# Altium schematic sheet 01_PSU.SchDoc
size A3; SheetNumber: 1
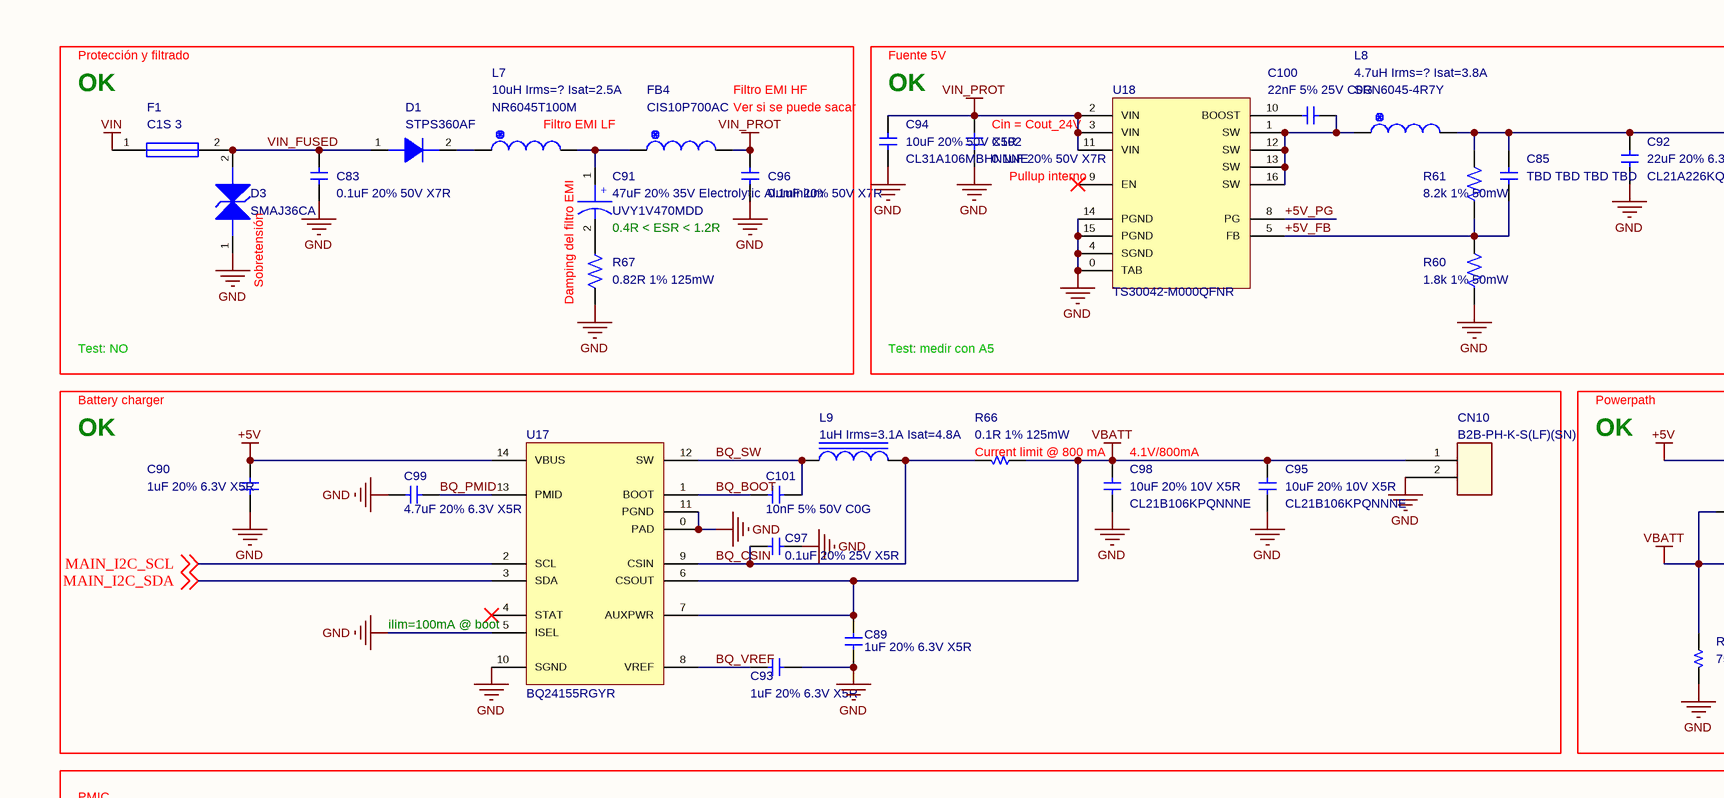
[diagram p0: 01_PSU.SchDoc, top left]
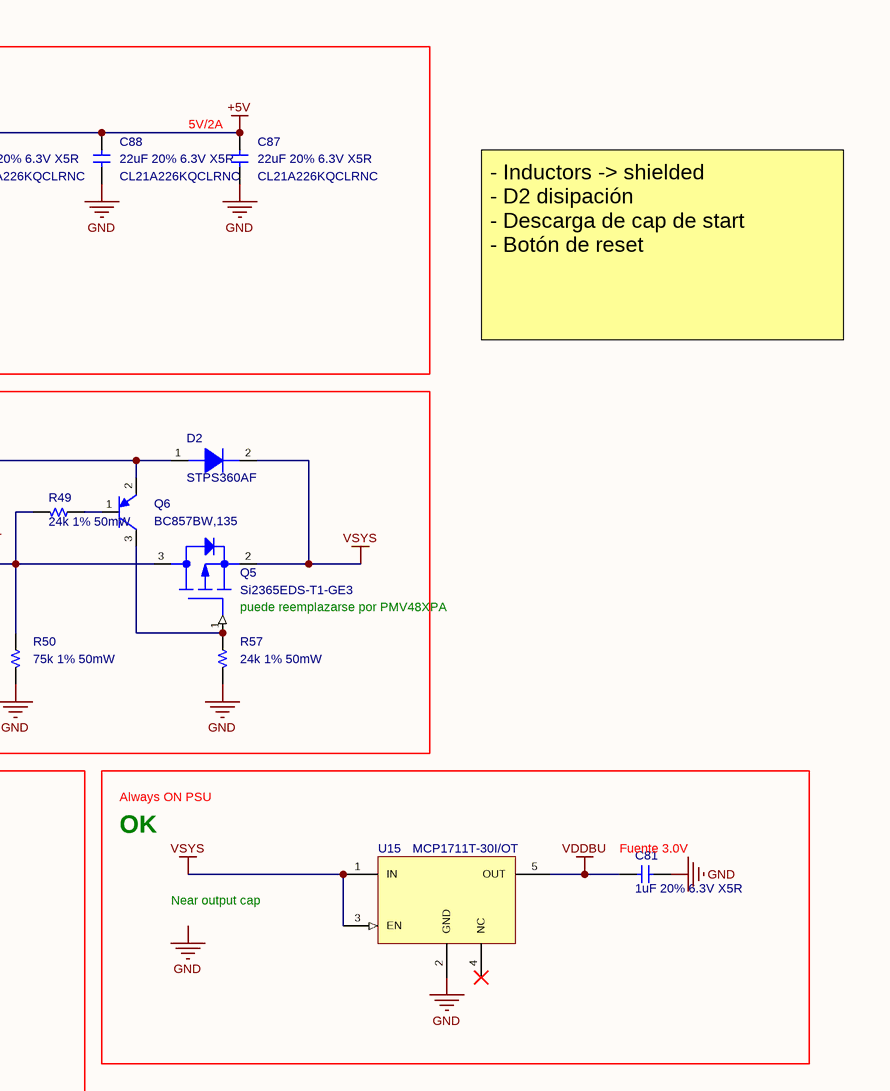
[diagram p1: 01_PSU.SchDoc, top right]
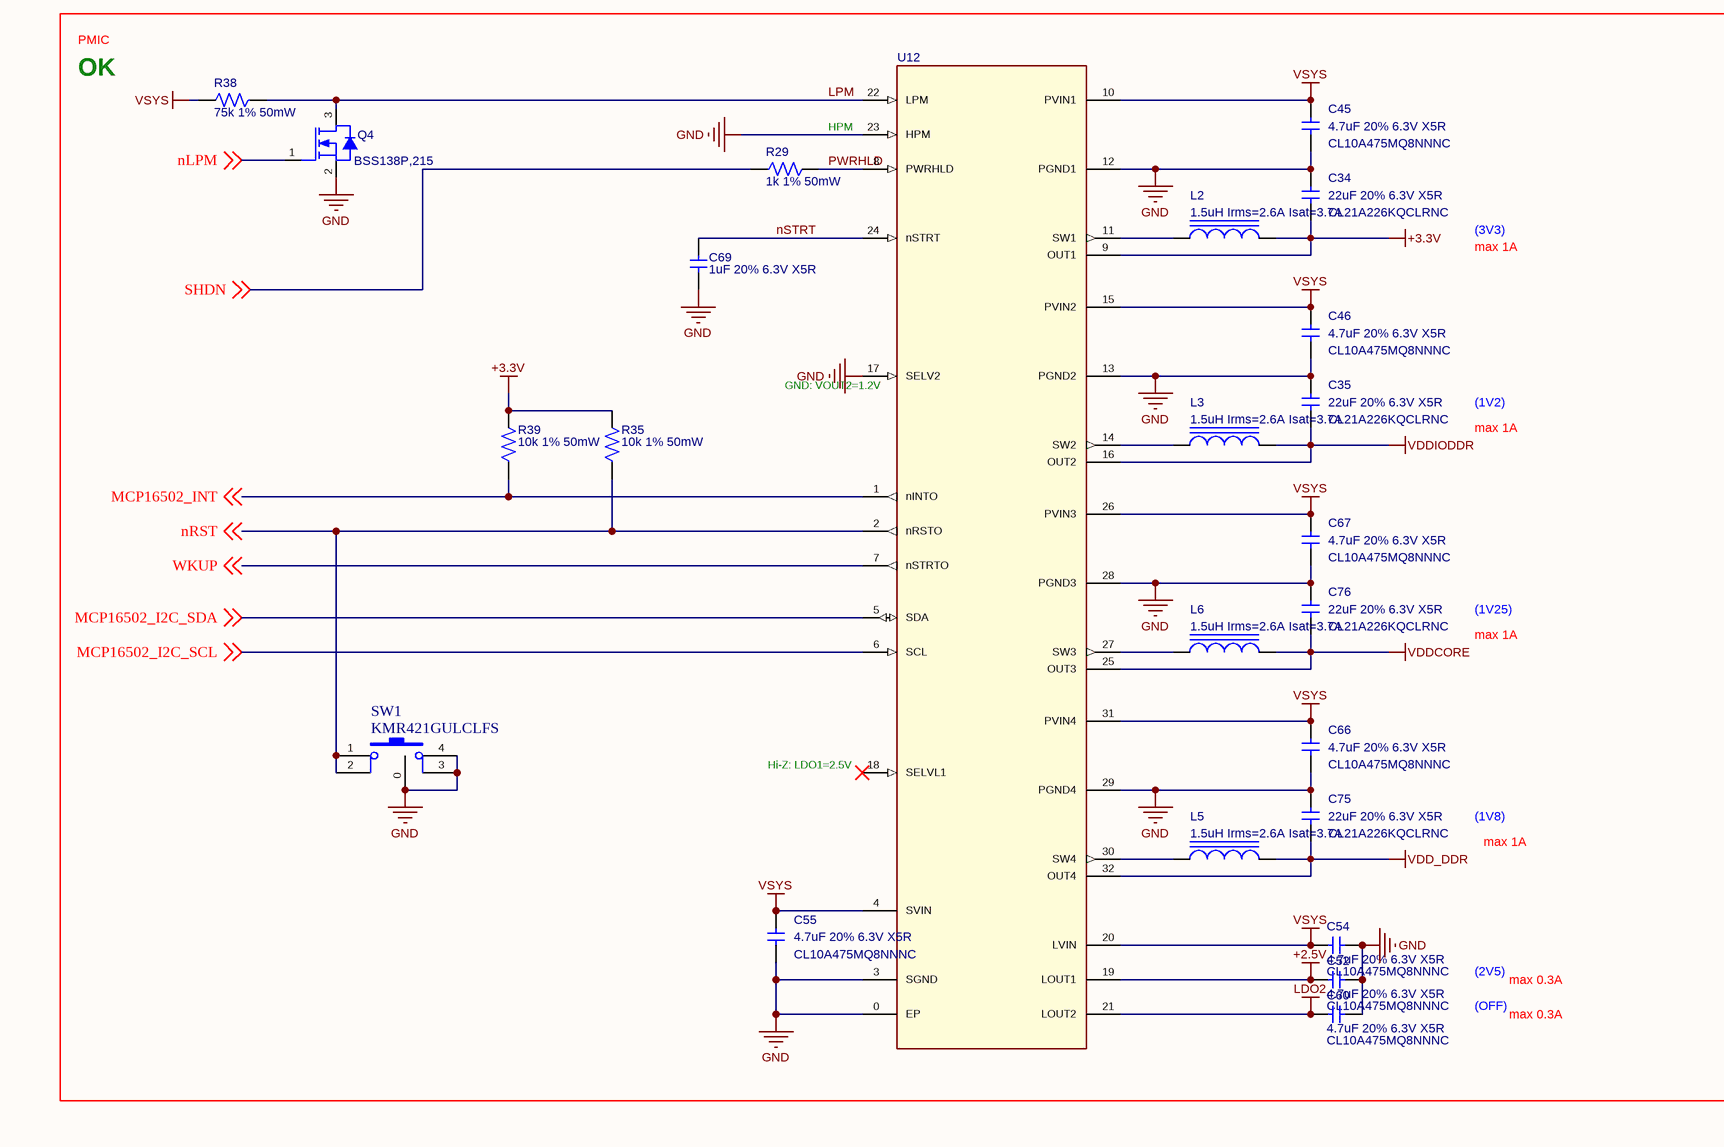
[diagram p2: 01_PSU.SchDoc, bottom left]

## Parts
C34  22uF 20% 6.3V X5R  MFG_PN: CL21A226KQCLRNC  [CAPC2012X140N]
C35  22uF 20% 6.3V X5R  MFG_PN: CL21A226KQCLRNC  [CAPC2012X140N]
C45  4.7uF 20% 6.3V X5R  MFG_PN: CL10A475MQ8NNNC  [CAPC1608X90N]
C46  4.7uF 20% 6.3V X5R  MFG_PN: CL10A475MQ8NNNC  [CAPC1608X90N]
C52  4.7uF 20% 6.3V X5R  MFG_PN: CL10A475MQ8NNNC  [CAPC1608X90N]
C54  4.7uF 20% 6.3V X5R  MFG_PN: CL10A475MQ8NNNC  [CAPC1608X90N]
C55  4.7uF 20% 6.3V X5R  MFG_PN: CL10A475MQ8NNNC  [CAPC1608X90N]
C60  4.7uF 20% 6.3V X5R  MFG_PN: CL10A475MQ8NNNC  [CAPC1608X90N]
C66  4.7uF 20% 6.3V X5R  MFG_PN: CL10A475MQ8NNNC  [CAPC1608X90N]
C67  4.7uF 20% 6.3V X5R  MFG_PN: CL10A475MQ8NNNC  [CAPC1608X90N]
C69  1uF 20% 6.3V X5R  [CAPC1005N]
C75  22uF 20% 6.3V X5R  MFG_PN: CL21A226KQCLRNC  [CAPC2012X140N]
C76  22uF 20% 6.3V X5R  MFG_PN: CL21A226KQCLRNC  [CAPC2012X140N]
C81  1uF 20% 6.3V X5R  [CAPC1005N]
C83  0.1uF 20% 50V X7R  [CAPC1608X90N]
C85  TBD TBD TBD TBD  [CAPC1005N]
C87  22uF 20% 6.3V X5R  MFG_PN: CL21A226KQCLRNC  [CAPC2012X140N]
C88  22uF 20% 6.3V X5R  MFG_PN: CL21A226KQCLRNC  [CAPC2012X140N]
C89  1uF 20% 6.3V X5R  [CAPC1005N]
C90  1uF 20% 6.3V X5R  [CAPC1005N]
C91  47uF 20% 35V Electrolytic Aluminium  MFG_PN: UVY1V470MDD  [CAPPR2-5x12]
C92  22uF 20% 6.3V X5R  MFG_PN: CL21A226KQCLRNC  [CAPC2012X140N]
C93  1uF 20% 6.3V X5R  [CAPC1005N]
C94  10uF 20% 50V X5R  MFG_PN: CL31A106MBHNNNE  [CAPC3216X180N]
C95  10uF 20% 10V X5R  MFG_PN: CL21B106KPQNNNE  [CAPC2012X140N]
C96  0.1uF 20% 50V X7R  [CAPC1608X90N]
C97  0.1uF 20% 25V X5R  [CAPC1005N]
C98  10uF 20% 10V X5R  MFG_PN: CL21B106KPQNNNE  [CAPC2012X140N]
C99  4.7uF 20% 6.3V X5R  [CAPC1608X90N]
C100  22nF 5% 25V C0G  [CAPC1005N]
C101  10nF 5% 50V C0G  [CAPC1005N]
C102  0.1uF 20% 50V X7R  [CAPC1608X90N]
CN10  B2B-PH-K-S(LF)(SN)  [B2B-PH-K-S(LF)(SN)]
D1  STPS360AF  [SODFL4725X105N]
D2  STPS360AF  [SODFL4725X105N]
D3  SMAJ36CA  [DIOM5226X203N]
F1  C1S 3  [RESC3216N]
FB4  CIS10P700AC  [INDC1608X95N]
L2  1.5uH Irms=2.6A Isat=3.7A  [INDC2520N]
L3  1.5uH Irms=2.6A Isat=3.7A  [INDC2520N]
L5  1.5uH Irms=2.6A Isat=3.7A  [INDC2520N]
L6  1.5uH Irms=2.6A Isat=3.7A  [INDC2520N]
L7  10uH Irms=? Isat=2.5A  MFG_PN: NR6045T100M  [NR6045]
L8  4.7uH Irms=? Isat=3.8A  MFG_PN: SRN6045-4R7Y  [SRN6045]
L9  1uH Irms=3.1A Isat=4.8A  [INDC2520N]
Q4  BSS138P,215  [SOT95P230X110-3N]
Q5  Si2365EDS-T1-GE3  [SOT95P230X110-3N]
Q6  BC857BW,135  [SOT65P210X110-3N]
R29  1k 1% 50mW  [RESC1005X40N]
R35  10k 1% 50mW  [RESC1005X40N]
R38  75k 1% 50mW  [RESC1005X40N]
R39  10k 1% 50mW  [RESC1005X40N]
R49  24k 1% 50mW  [RESC1005X40N]
R50  75k 1% 50mW  [RESC1005X40N]
R57  24k 1% 50mW  [RESC1005X40N]
R60  1.8k 1% 50mW  [RESC1005X40N]
R61  8.2k 1% 50mW  [RESC1005X40N]
R66  0.1R 1% 125mW  [RESC2012X50N]
R67  0.82R 1% 125mW  [RESC2012X50N]
SW1  KMR421GULCLFS  [KMR4]
U12  MCP16502TAC-E/S8B  [QFN50P500X500X90-33N]  (value not drawn)
U15  MCP1711T-30I/OT  [SOT95P284X122-5N]
U17  BQ24155RGYR  [VQFN14]
U18  TS30042-M000QFNR  [QFN50P300X300X100-17AN]

## Blocks framed on the sheet
OK: C83 C91 C96 D1 D3 F1 FB4 L7 R67
OK: C85 C87 C88 C92 C94 C100 C102 L8 R60 R61 U18
OK: C89 C90 C93 C95 C97-C99 C101 CN10 L9 R66 U17
OK: D2 Q5 Q6 R49 R50 R57
OK: C34 C35 C45 C46 C52 C54 C55 C60 C66 C67 C69 C75 C76 L2 L3 L5 L6 Q4 R29 R35 R38 R39 SW1 U12
OK: C81 U15

## Nets
+2.5V: C52.1 U12.19(LOUT1)
+3.3V: C34.2 L2.2 R35.2 R39.2 U12.9(OUT1)
+5V: C85.2 C87.1 C88.1 C90.1 C92.1 D2.1(A) L8.2 Q6.2(E) R61.2 U17.14(VBUS)
GND: C34.1 C35.1 C45.2 C46.2 C52.2 C54.2 C55.2 C60.2 C66.2 C67.2 C69.2 C75.1 C76.1 C81.1 C83.2 C87.2 C88.2 C89.1 C90.2 C92.2 C93.1 C94.2 C95.2 C96.2 C97.1 C98.2 C99.2 C102.2 CN10.2 D3.1(ANODE) Q4.2(S) R50.2 R57.2 R60.1 R67.2 SW1.0(M) SW1.3 SW1.4 U12.0(EP) U12.3(SGND) U12.12(PGND1) U12.13(PGND2) U12.17(SELV2) U12.23(HPM) U12.28(PGND3) U12.29(PGND4) U15.2(GND) U17.0(PAD) U17.5(ISEL) U17.10(SGND) U17.11(PGND) U18.0(TAB) U18.4(SGND) U18.14(PGND) U18.15(PGND)
LDO2: C60.1 U12.21(LOUT2)
VBATT: C89.2 C95.1 C98.1 CN10.1 Q5.3(DRAIN) R49.2 R50.1 R66.1 U17.6(CSOUT) U17.7(AUXPWR)
VDD_DDR: C75.2 L5.2 U12.32(OUT4)
VDDBU: C81.2 U15.5(OUT)
VDDCORE: C76.2 L6.2 U12.25(OUT3)
VDDIODDR: C35.2 L3.2 U12.16(OUT2)
VIN: F1.1
VIN_PROT: C94.1 C96.1 C102.1 FB4.2 U18.2(VIN) U18.3(VIN) U18.11(VIN)
VSYS: C45.1 C46.1 C54.1 C55.1 C66.1 C67.1 D2.2(K) Q5.2(SOURCE) R38.2 U12.4(SVIN) U12.10(PVIN1) U12.15(PVIN2) U12.20(LVIN) U12.26(PVIN3) U12.31(PVIN4) U15.1(IN) U15.3(EN)
+5V_FB: C85.1 R60.2 R61.1 U18.5(FB)
+5V_PG: U18.8(PG)
BQ_BOOT: C101.2 U17.1(BOOT)
BQ_CSIN: C97.2 L9.2 R66.2 U17.9(CSIN)
BQ_PMID: C99.1 U17.13(PMID)
BQ_SW: C101.1 L9.1 U17.12(SW)
BQ_VREF: C93.2 U17.8(VREF)
LPM: Q4.3(D) R38.1 U12.22(LPM)
MAIN_I2C_SCL: U17.2(SCL) ; off-sheet MAIN_I2C_SCL
MAIN_I2C_SDA: U17.3(SDA) ; off-sheet MAIN_I2C_SDA
MCP16502_I2C_SCL: U12.6(SCL) ; off-sheet MCP16502_I2C_SCL
MCP16502_I2C_SDA: U12.5(SDA) ; off-sheet MCP16502_I2C_SDA
MCP16502_INT: R39.1 U12.1(nINTO) ; off-sheet MCP16502_INT
nLPM: Q4.1(G) ; off-sheet nLPM
nRST: R35.1 SW1.1 SW1.2 U12.2(nRSTO) ; off-sheet nRST
nSTRT: C69.1 U12.24(nSTRT)
PWRHLD: R29.2 U12.8(PWRHLD)
SHDN: R29.1 ; off-sheet SHDN
VIN_FUSED: C83.1 D1.1(A) D3.2(CATHODE) F1.2
WKUP: U12.7(nSTRTO) ; off-sheet WKUP
NetC91_1: C91.1 FB4.1 L7.2
NetC91_2: C91.2 R67.1
NetC100_1: C100.1 L8.1 U18.1(SW) U18.12(SW) U18.13(SW) U18.16(SW)
NetC100_2: C100.2 U18.10(BOOST)
NetD1_2: D1.2(K) L7.1
NetL2_1: L2.1 U12.11(SW1)
NetL3_1: L3.1 U12.14(SW2)
NetL5_1: L5.1 U12.30(SW4)
NetL6_1: L6.1 U12.27(SW3)
NetQ5_1: Q5.1(GATE) Q6.3(C) R57.1
NetQ6_1: Q6.1(B) R49.1

Not connected (* = marked no-connect by the designer): U12 18(SELVL1)*; U15 4(NC)*; U17 4(STAT)*; U18 9(EN)*

## Notes on the sheet
- Protección y filtrado
- Filtro EMI LF
- Filtro EMI HF
- Ver si se puede sacar
- Fuente 5V
- (near C102) Cin = Cout_24V
- (near C87) 5V/2A
- (near U18) Pullup interno
- (near D3) Sobretensión
- Damping del filtro EMI
- 0.4R < ESR < 1.2R
- Test: NO
- Test: medir con A5
- - Inductors -> shielded
  - D2 disipación
  - Descarga de cap de start
  - Botón de reset
- Battery charger
- (near R66) Current limit @ 800 mA
- (near C98) 4.1V/800mA
- Powerpath
- (near U17) ilim=100mA @ boot
- (near Q5) puede reemplazarse por PMV48XPA
- PMIC
- Always ON PSU
- HPM
- Near output cap
- (near C81) Fuente 3.0V
- (3V3)
- max 1A
- (near U12) GND: VOUT2=1.2V
- (1V2)
- (1V25)
- (near U12) Hi-Z: LDO1=2.5V
- (1V8)
- (2V5)
- (OFF)
- max 0.3A
- Labels drawn without touching a wire or pin: GND
- (in symbol CP) +

## Library data of the parts
C34 C35 C75 C76 C87 C88 C92 = C_Dup1: Capacitor, Ceramic; FP_DESC: C0805; MFG: SAMSUNG; Symbol Checked: Ok; Replacement Allowed: Ask; Footprint Checked: Assign OK, Footprint OK; TECHNOLOGY: X5R; TOLERANCE: 20%; VALUE: 22uF; VOLTAGE: 6.3V
C45 C46 C52 C54 C55 C60 C66 C67 = C_Dup1: Capacitor, Ceramic; FP_DESC: C0603; MFG: SAMSUNG; Symbol Checked: Ok; Replacement Allowed: Ask; Footprint Checked: Assign OK, Footprint OK; TECHNOLOGY: X5R; TOLERANCE: 20%; VALUE: 4.7uF; VOLTAGE: 6.3V
C69 C90 = C_Dup1: Capacitor, Ceramic; MFG: SAMSUNG; MFG_PN: CL05A105KQ5NNNC; FP_DESC: C0402; Symbol Checked: Ok; Replacement Allowed: Ask; Footprint Checked: Assign OK, Footprint OK; TECHNOLOGY: X5R; TOLERANCE: 20%; VALUE: 1uF; VOLTAGE: 6.3V
C81 C89 C93 = C: Capacitor, Ceramic; MFG: SAMSUNG; Symbol Checked: Ok; FP_DESC: C0402; MFG_PN: CL05A105KQ5NNNC; Replacement Allowed: Ask; Footprint Checked: Assign OK, Footprint OK; Value: 1uF; TOLERANCE: 20%; VOLTAGE: 6.3V; TECHNOLOGY: X5R
C83 C96 C102 = C_Dup1: Capacitor, Ceramic; MFG: SAMSUNG; MFG_PN: CL10B104KB8NNWC; FP_DESC: C0603; Symbol Checked: Ok; Replacement Allowed: Ask; Footprint Checked: Assign OK, Footprint OK; TECHNOLOGY: X7R; TOLERANCE: 20%; VALUE: 0.1uF; VOLTAGE: 50V
C85 C100 = C_Dup1: Capacitor, Ceramic; FP_DESC: C0402; MFG_PN: <GENERIC>; Symbol Checked: Ok; Replacement Allowed: Yes; MFG: <GENERIC>; Footprint Checked: Assign OK, Footprint OK
  C85: TECHNOLOGY: TBD; TOLERANCE: TBD; VALUE: TBD; VOLTAGE: TBD
  C100: TECHNOLOGY: C0G; TOLERANCE: 5%; VALUE: 22nF; VOLTAGE: 25V
C91 = CP: Capacitor, Electrolytic; FP_DESC: Cap. Pol. D=5mm, LS=2mm, H=12.5mm; MFG: NICHICON; Symbol Checked: Ok; Replacement Allowed: Ask; Footprint Checked: Assign OK, Footprint OK; TECHNOLOGY: Electrolytic Aluminium; TOLERANCE: 20%; VALUE: 47uF; VOLTAGE: 35V
C94 = C_Dup1: Capacitor, Ceramic; FP_DESC: C1206; MFG: SAMSUNG; Symbol Checked: Ok; Replacement Allowed: Ask; Footprint Checked: Assign OK, Footprint OK; TECHNOLOGY: X5R; TOLERANCE: 20%; VALUE: 10uF; VOLTAGE: 50V
C95 C98 = C_Dup1: Capacitor, Ceramic; MFG: SAMSUNG; FP_DESC: C0805; Symbol Checked: Ok; Replacement Allowed: Ask; Footprint Checked: Assign OK, Footprint OK; TECHNOLOGY: X5R; TOLERANCE: 20%; VALUE: 10uF; VOLTAGE: 10V
C97 = C_Dup1: Capacitor, Ceramic; FP_DESC: C0402; MFG_PN: CL05A104KA5NNNC; MFG: SAMSUNG; Symbol Checked: Ok; Replacement Allowed: Ask; Footprint Checked: Assign OK, Footprint OK; TECHNOLOGY: X5R; TOLERANCE: 20%; VALUE: 0.1uF; VOLTAGE: 25V
C99 = C: Capacitor, Ceramic; MFG: SAMSUNG; Symbol Checked: Ok; FP_DESC: C0603; MFG_PN: CL10A475MQ8NNNC; Replacement Allowed: Ask; Footprint Checked: Assign OK, Footprint OK; Value: 4.7uF; TOLERANCE: 20%; VOLTAGE: 6.3V; TECHNOLOGY: X5R
C101 = C: Capacitor, Ceramic; MFG: <GENERIC>; Symbol Checked: Ok; FP_DESC: C0402; Replacement Allowed: Yes; Footprint Checked: Assign OK, Footprint OK; MFG_PN: <GENERIC>; Value: 10nF; TOLERANCE: 5%; VOLTAGE: 50V; TECHNOLOGY: C0G
CN10 = CON2: Header, Male pins, 1x2, 2mm, Vertical; MFG: JST; Symbol Checked: Ok; Replacement Allowed: Ask; MFG_PN: B2B-PH-K-S(LF)(SN); FP_DESC: Header, Male pins, 1x2, 2mm, Vertical; Footprint Checked: Assign OK, Footprint OK
D1 D2 = DIODE_1: DIODE; FP_DESC: SOD128; MFG: ST; Symbol Checked: Ok; Replacement Allowed: No; MFG_PN: STPS360AF; Footprint Checked: Assign OK, Footprint OK
D3 = TVS: FP_DESC: SMA; MFG: BOURNS; Symbol Checked: Ok; Replacement Allowed: No; MFG_PN: SMAJ36CA; Footprint Checked: Assign OK, Footprint OK
F1 = Fuse 1: Fuse; FP_DESC: R1206; MFG: BEL; POWER: 250mW; VALUE: 3A; VOLTAGE: 63V; Symbol Checked: Ok; Replacement Allowed: No; MFG_PN: C1S 3; Footprint Checked: Assign OK, Footprint OK
FB4 = L: Ferrite Bead; MFG: SAMSUNG; FP_DESC: L0603; Symbol Checked: Ok; Replacement Allowed: No; MFG_PN: CIS10P700AC; Footprint Checked: Assign OK, Footprint OK
L2 L3 L5 L6 = L_CORE: Inductor, Ferrite core; MFG: TAIYO YUDEN; Symbol Checked: Ok; FP_DESC: L1008; MFG_PN: MAMK2520H1R5M; Replacement Allowed: No; Footprint Checked: Assign OK, Footprint OK; Value: 1.5uH; EXTRA_DATA: Irms=2.6A Isat=3.7A
L7 = L: Inductor, Ferrite core; MFG: TAIYO YUDEN; FP_DESC: Inductor, 6.0x6.0, H=4.5; Symbol Checked: Ok; Replacement Allowed: No; Footprint Checked: Assign OK, Footprint OK; VALUE: 10uH; EXTRA_DATA: Irms=? Isat=2.5A
L8 = L: Inductor, Ferrite core; MFG: BOURNS; FP_DESC: Inductor, 6.0x6.0, H=4.5; Symbol Checked: Ok; Replacement Allowed: No; Footprint Checked: Assign OK, Footprint OK; VALUE: 4.7uH; EXTRA_DATA: Irms=? Isat=3.8A
L9 = L_CORE: Inductor, Ferrite core; MFG: TAIYO YUDEN; Symbol Checked: Ok; FP_DESC: L1008; MFG_PN: MAMK2520H1R0M; Replacement Allowed: No; Footprint Checked: Assign OK, Footprint OK; Value: 1uH; EXTRA_DATA: Irms=3.1A Isat=4.8A
Q4 = TRA1147: MOSFET, N channel; FP_DESC: SOT23-3; MFG: NXP; Symbol Checked: Ok; Replacement Allowed: No; Footprint Checked: Assign OK, Footprint OK; MFG_PN: BSS138P,215
Q5 = DMG1013UW: MOSFET, P channel; MFG: VISHAY; FP_DESC: SOT23-3; Symbol Checked: Ok; Replacement Allowed: No; MFG_PN: Si2365EDS-T1-GE3; Footprint Checked: Assign OK, Footprint OK
Q6 = MMBT2907LT1: PNP; FP_DESC: SOT323; MFG: NXP; Symbol Checked: Ok; Replacement Allowed: No; MFG_PN: BC857BW,135; Footprint Checked: Assign OK, Footprint OK
R29 R35 R38 R39 R60 R61 = R: Resistor, SMD; FP_DESC: R0402; MFG_PN: <GENERIC>; Symbol Checked: Ok; Replacement Allowed: Yes; MFG: <GENERIC>; Footprint Checked: Assign OK, Footprint OK; POWER: 50mW; TOLERANCE: 1%
  R29: VALUE: 1k
  R35 R39: VALUE: 10k
  R38: VALUE: 75k
  R60: VALUE: 1.8k
  R61: VALUE: 8.2k
R49 R50 R57 = R: Resistor, SMD; MFG: <GENERIC>; Symbol Checked: Ok; FP_DESC: R0402; Replacement Allowed: Yes; Footprint Checked: Assign OK, Footprint OK; MFG_PN: <GENERIC>; POWER: 50mW; TOLERANCE: 1%
  R49 R57: Value: 24k
  R50: Value: 75k
R66 = R: Resistor, SMD; MFG: <GENERIC>; Symbol Checked: Ok; FP_DESC: R0805; Replacement Allowed: Yes; Footprint Checked: Assign OK, Footprint OK; MFG_PN: <GENERIC>; Value: 0.1R; POWER: 125mW; TOLERANCE: 1%
R67 = R: Resistor, SMD; FP_DESC: R0805; MFG_PN: <GENERIC>; Symbol Checked: Ok; Replacement Allowed: Yes; MFG: <GENERIC>; Footprint Checked: Assign OK, Footprint OK; POWER: 125mW; TOLERANCE: 1%; VALUE: 0.82R
SW1 = SW-PB: Switch; FP_DESC: Tact switch, 4.6mm x 2.8mm; MFG: C&K; Replacement Allowed: Ask; Symbol Checked: Ok; Footprint Checked: Assign OK, Footprint OK; MFG_PN: KMR421GULCLFS
U12 = MIC8644: High-Performance PMIC for SAMA5DX/SAM9X6 MPUs; FP_DESC: QFN32+TAB; MFG: MICROCHIP; Symbol Checked: Ok; Replacement Allowed: No; Footprint Checked: Assign OK, Footprint OK; MFG_PN: MCP16502TAC-E/S8B
U15 = XC6504: Linear Voltage Regulator IC  1 Output  150mA SOT-25-5; MFG: MICROCHIP; FP_DESC: SOT23-5; Symbol Checked: Ok; Replacement Allowed: No; MFG_PN: MCP1711T-30I/OT; Footprint Checked: Assign OK, Footprint OK
U17 = BQ24155RGYR: Charger IC Lithium Ion/Polymer 14-VQFN (3.5x3.5); MFG: TI; FP_DESC: VFQFN-14; Symbol Checked: Ok; Replacement Allowed: No; MFG_PN: BQ24155RGYR; Footprint Checked: Assign OK, Footprint OK
U18 = MCP16322: 24V Input, 1A/2A Output, High Efficiency Synchronous Buck Regulator with Power Good Indication; FP_DESC: QFN16+TAB; MFG: SEMTECH; Symbol Checked: Ok; Replacement Allowed: No; MFG_PN: TS30042-M000QFNR; Footprint Checked: Assign OK, Footprint OK